# EAGLE design Pop-Up Keller Pressure Sensor Interface Board - Rev 4.1 (EAGLE 9.2.2)
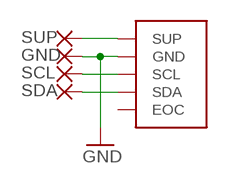
[diagram p0: schematic, sheet 1]

## Parts
GND  SMD075X015  [SMD-0,75X0,15]
P1  4LD  KELLER-4-LD  [KELLER-4-LD]
SCL  SMD075X015  [SMD-0,75X0,15]
SDA  SMD075X015  [SMD-0,75X0,15]
SUP  SMD075X015  [SMD-0,75X0,15]

## Nets
GND: GND.P$1(P) P1.GND
N$1: P1.SUP SUP.P$1(P)
N$2: P1.SCL SCL.P$1(P)
N$3: P1.SDA SDA.P$1(P)
Unconnected: P1.EOC

## Library data of the parts
GND SCL SDA SUP = wirepad:SMD075X015
P1 = User-Submitted:KELLER-4-LD

## Board
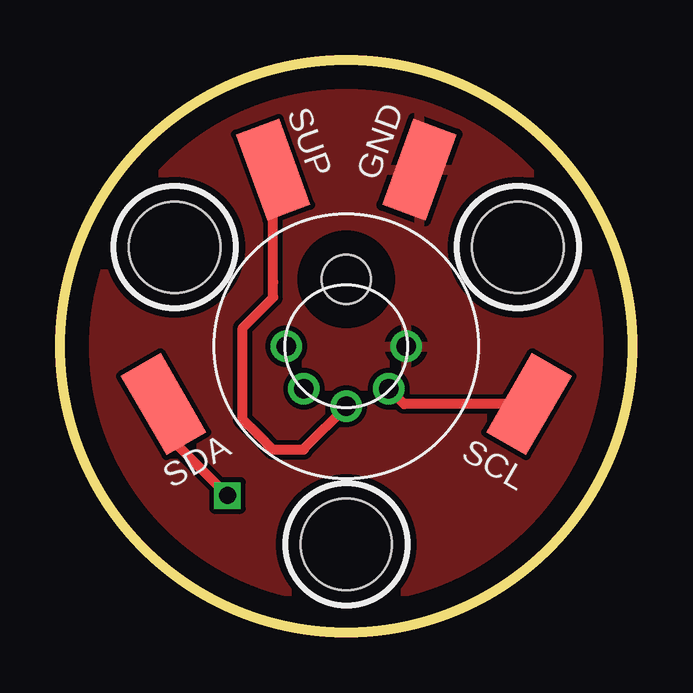
[diagram p1: board, top side]
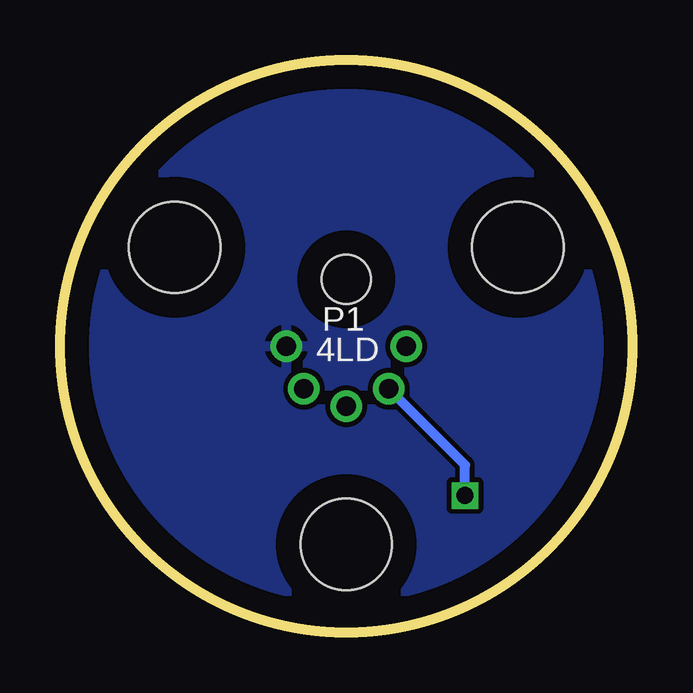
[diagram p2: board, bottom side, seen from below]

Size 23.88 x 23.88 mm. Coordinates in mm from the lower left corner, seen from the top.
Outline: circle at 11.94,11.94 radius 11.94
Copper layers (1*16): Top 0.035mm / dielectric 1.5mm / Bottom 0.035mm
Design rules "default": minimum track width 10mil, minimum drill 24mil, track to track 8mil, track to pad 8mil, pad to pad 8mil, via to via 8mil, smd to smd 8mil, copper to edge 40mil, drill to drill 8mil, minimum pad ring 10mil, minimum via ring 8mil, stop-mask expansion 4mil, vias tented up to drill 0mil, thermal gap 10mil
Holes 3.81 mm at 19.09,16.07 11.94,3.68 4.79,16.07
Holes 2.03 mm at 11.94,14.73

### Footprints (pad centres in the part's own frame; a part is rotated, then mirrored left to right if it is on the bottom)
SMD-0,75X0,15 = smd 1.905 x 3.81: P$1 0,0
KELLER-4-LD = drill 0.8: EOC -2.5,0; GND 2.5,0; SCL 1.768,-1.768; SDA -1.768,-1.768; SUP 0,-2.5

### Placement (x,y rotation side)
GND  14.99,19.3 160 top
P1  11.94,11.94 0 top
SCL  19.56,9.53 150 top
SDA  4.32,9.53 30 top
SUP  8.89,19.3 20 top

### Tracks (layer width: path | path; a pad name or v marks a point on that pad's centre or on a via)
GND
  pour Top: -2.54,-2.54 26.67,-2.54 26.67,26.67 -2.54,26.67
  pour Bottom: -1.27,-1.27 25.4,-1.27 25.4,25.4 -1.27,25.4
N$1
  Top 0.406: P1.SUP 10.16,7.66 10.16,7.62 8.89,7.62 8.26,8.26 7.62,8.89 7.62,12.7 8.89,13.97 8.89,14.61 SUP.P$1
N$2
  Top 0.406: SCL.P$1 14.35,9.53 P1.SCL
N$3  (via drill 0.7)
  Top 0.406: SDA.P$1 4.32,8.38 5.71,6.99 v6.99,5.71
  Bottom 0.406: P1.SDA 8.26,8.26 6.99,6.99 v6.99,5.71